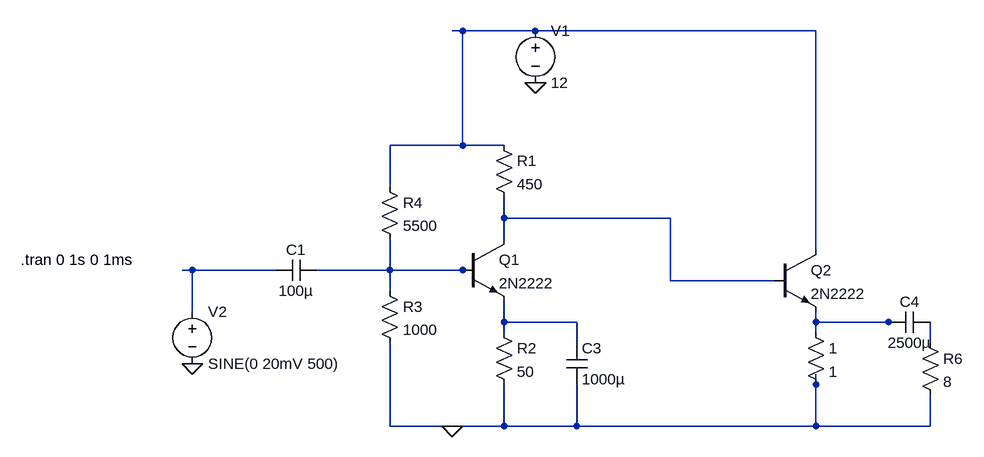
[diagram p0: schematic Common Emitter with Common Collector.asc]
Common Emitter with Common Collector.asc, the LTspice schematic file:
Version 4
SHEET 1 1316 680
WIRE 160 -256 144 -256
WIRE 272 -256 160 -256
WIRE 704 -256 272 -256
WIRE 160 -80 160 -256
WIRE 160 -80 48 -80
WIRE 224 -80 160 -80
WIRE 48 -16 48 -80
WIRE 224 32 224 0
WIRE 480 32 224 32
WIRE 224 64 224 32
WIRE 704 80 704 -256
WIRE -256 112 -272 112
WIRE -128 112 -256 112
WIRE 48 112 48 64
WIRE 48 112 -64 112
WIRE 160 112 48 112
WIRE 176 112 160 112
WIRE 480 128 480 32
WIRE 640 128 480 128
WIRE 48 144 48 112
WIRE -256 176 -256 112
WIRE 224 192 224 160
WIRE 336 192 224 192
WIRE 704 192 704 176
WIRE 816 192 704 192
WIRE 832 192 816 192
WIRE 224 208 224 192
WIRE 704 208 704 192
WIRE 336 224 336 192
WIRE 880 224 880 192
WIRE 704 288 704 272
WIRE 48 352 48 224
WIRE 144 352 48 352
WIRE 224 352 224 288
WIRE 224 352 144 352
WIRE 336 352 336 288
WIRE 336 352 224 352
WIRE 704 352 704 288
WIRE 704 352 336 352
WIRE 880 352 880 304
WIRE 880 352 704 352
FLAG 272 -176 0
FLAG 144 352 0
FLAG -256 256 0
SYMBOL npn 160 64 R0
SYMATTR InstName Q1
SYMATTR Value 2N2222
SYMBOL res 208 -96 R0
SYMATTR InstName R1
SYMATTR Value 450
SYMBOL voltage 272 -272 R0
WINDOW 123 0 0 Left 2
WINDOW 39 0 0 Left 2
SYMATTR InstName V1
SYMATTR Value 12
SYMBOL res 32 -32 R0
SYMATTR InstName R4
SYMATTR Value 5500
SYMBOL res 32 128 R0
SYMATTR InstName R3
SYMATTR Value 1000
SYMBOL res 208 192 R0
SYMATTR InstName R2
SYMATTR Value 50
SYMBOL cap 320 224 R0
SYMATTR InstName C3
SYMATTR Value 1000µ
SYMBOL cap -64 96 R90
WINDOW 0 0 32 VBottom 2
WINDOW 3 32 32 VTop 2
SYMATTR InstName C1
SYMATTR Value 100µ
SYMBOL voltage -256 160 R0
WINDOW 123 0 0 Left 2
WINDOW 39 0 0 Left 2
SYMATTR InstName V2
SYMATTR Value SINE(0 20mV 500)
SYMBOL npn 640 80 R0
SYMATTR InstName Q2
SYMATTR Value 2N2222
SYMBOL res 688 192 R0
SYMATTR InstName 1
SYMATTR Value 1
SYMBOL cap 880 176 R90
WINDOW 0 0 32 VBottom 2
WINDOW 3 32 32 VTop 2
SYMATTR InstName C4
SYMATTR Value 2500µ
SYMBOL res 864 208 R0
SYMATTR InstName R6
SYMATTR Value 8
TEXT -520 96 Left 2 !.tran 0 1s 0 1ms

The netlist it stands for:
* Common Emitter with Common Collector.asc
Q1 N002 N004 N005 0 2N2222
R1 N001 N002 450
V1 N001 0 12
R4 N001 N004 5500
R3 N004 0 1000
R2 N005 0 50
C3 N005 0 1000µ
C1 N004 N003 100µ
V2 N003 0 SINE(0 20mV 500)
Q2 N001 N002 N006 0 2N2222
R§1 N006 0 1
C4 N007 N006 2500µ
R6 N007 0 8
.model NPN NPN
.model PNP PNP
.lib standard.bjt
.tran 0 1s 0 1ms
.backanno
.end